# Altium schematic sheet Encoder Fin ARM - MCU KL05 24VQFN.SchDoc
size A
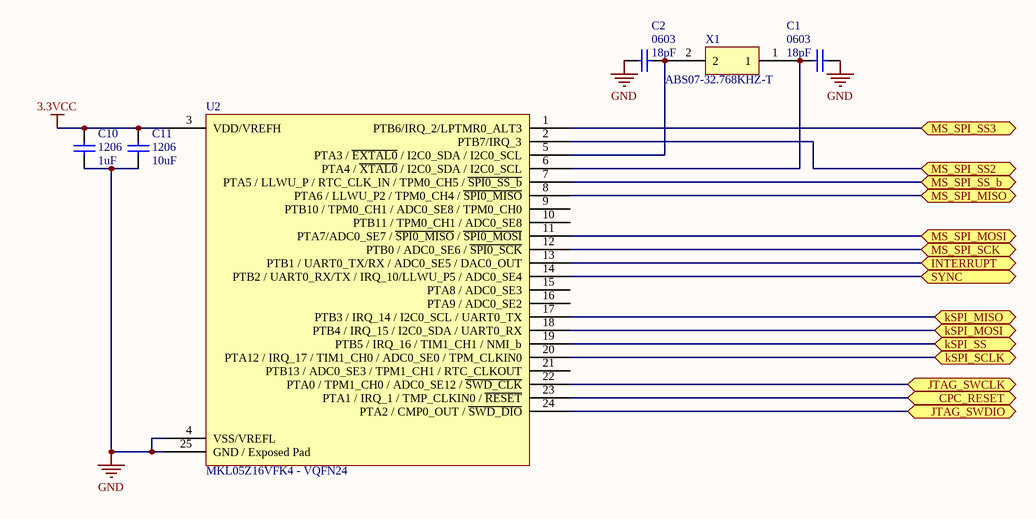
[diagram p0: Encoder Fin ARM - MCU KL05 24VQFN.SchDoc]

## Parts
C1  0603  value 18pF  [1608[0603]]
C2  0603  value 18pF  [1608[0603]]
C10  1206  value 1uF  [C1206]
C11  1206  value 10uF  [C1206]
U2  MKL05Z16VFK4 - VQFN24  [98ASA00474D]
X1  ABS07-32.768KHZ-T  [ABS07-32.768KHZ-T]

## Ports
CPC_RESET, INTERRUPT, JTAG_SWCLK, JTAG_SWDIO, kSPI_MISO, kSPI_MOSI, kSPI_SCLK, kSPI_SS, MS_SPI_MISO, MS_SPI_MOSI, MS_SPI_SCK, MS_SPI_SS2, MS_SPI_SS3, MS_SPI_SS_b, SYNC

## Nets
3.3VCC: C10.2 C11.2 U2.3(VDD/VREFH)
GND: C1.2 C2.2 C10.1 C11.1 U2.4(VSS/VREFL) U2.25(GND_/_Exposed_Pad)
CPC_RESET: U2.23(PTA1_/_IRQ_1_/_TMP_CLKIN0_/_~{RESET}) ; port CPC_RESET
INTERRUPT: U2.13(PTB1_/_UART0_TX/RX_/_ADC0_SE5_/_DAC0_OUT) ; port INTERRUPT
JTAG_SWCLK: U2.22(PTA0_/_TPM1_CH0_/_ADC0_SE12_/_~{SWD_CLK}) ; port JTAG_SWCLK
JTAG_SWDIO: U2.24(PTA2_/_CMP0_OUT_/_~{SWD_DIO}) ; port JTAG_SWDIO
kSPI_MISO: U2.17(PTB3_/_IRQ_14_/_I2C0_SCL_/_UART0_TX) ; port kSPI_MISO
kSPI_MOSI: U2.18(PTB4_/_IRQ_15_/_I2C0_SDA_/_UART0_RX) ; port kSPI_MOSI
kSPI_SCLK: U2.20(PTA12_/_IRQ_17_/_TIM1_CH0_/_ADC0_SE0_/_TPM_CLKIN0) ; port kSPI_SCLK
kSPI_SS: U2.19(PTB5_/_IRQ_16_/_TIM1_CH1_/_NMI_b) ; port kSPI_SS
MS_SPI_MISO: U2.8(PTA6_/_LLWU_P2_/_TPM0_CH4_/_~{SPI0_MISO}) ; port MS_SPI_MISO
MS_SPI_MOSI: U2.11(PTA7/ADC0_SE7_/_~{SPI0_MISO}_/_~{SPI0_MOSI}) ; port MS_SPI_MOSI
MS_SPI_SCK: U2.12(PTB0_/_ADC0_SE6_/_~{SPI0_SCK}) ; port MS_SPI_SCK
MS_SPI_SS2: U2.2(PTB7/IRQ_3) ; port MS_SPI_SS2
MS_SPI_SS3: U2.1(PTB6/IRQ_2/LPTMR0_ALT3) ; port MS_SPI_SS3
MS_SPI_SS_b: U2.7(PTA5_/_LLWU_P_/_RTC_CLK_IN_/_TPM0_CH5_/_~{SPI0_SS_b}) ; port MS_SPI_SS_b
SYNC: U2.14(PTB2_/_UART0_RX/TX_/_IRQ_10/LLWU_P5_/_ADC0_SE4) ; port SYNC
NetC1_1: C1.1 U2.6(PTA4_/_~{XTAL0}_/_I2C0_SDA_/_I2C0_SCL) X1.1
NetC2_1: C2.1 U2.5(PTA3_/_~{EXTAL0}_/_I2C0_SDA_/_I2C0_SCL) X1.2

Not connected (* = marked no-connect by the designer): U2 9(PTB10_/_TPM0_CH1_/_ADC0_SE8_/_TPM0_CH0) 10(PTB11_/_TPM0_CH1_/_ADC0_SE8) 15(PTA8_/_ADC0_SE3) 16(PTA9_/_ADC0_SE2) 21(PTB13_/_ADC0_SE3_/_TPM1_CH1_/_RTC_CLKOUT)

## Library data of the parts
C1 C2 C10 C11 = Cap Semi: Capacitor (Semiconductor SIM Model); Published: 8-Jun-2000; LatestRevisionDate: 29-May-2009; LatestRevisionNote: IPC-7351 Footprint Added.; PackageReference: C1206; Publisher: Altium Limited; PackageDescription: Chip Capacitor
U2 = MKL05Z16VFK4 - 24 Pin VQFN: ARM Cortex M0+
X1 = ABS07-32.768KHZ-T: ABS07-32.768KHZ-T RTC Crystal Oscillator